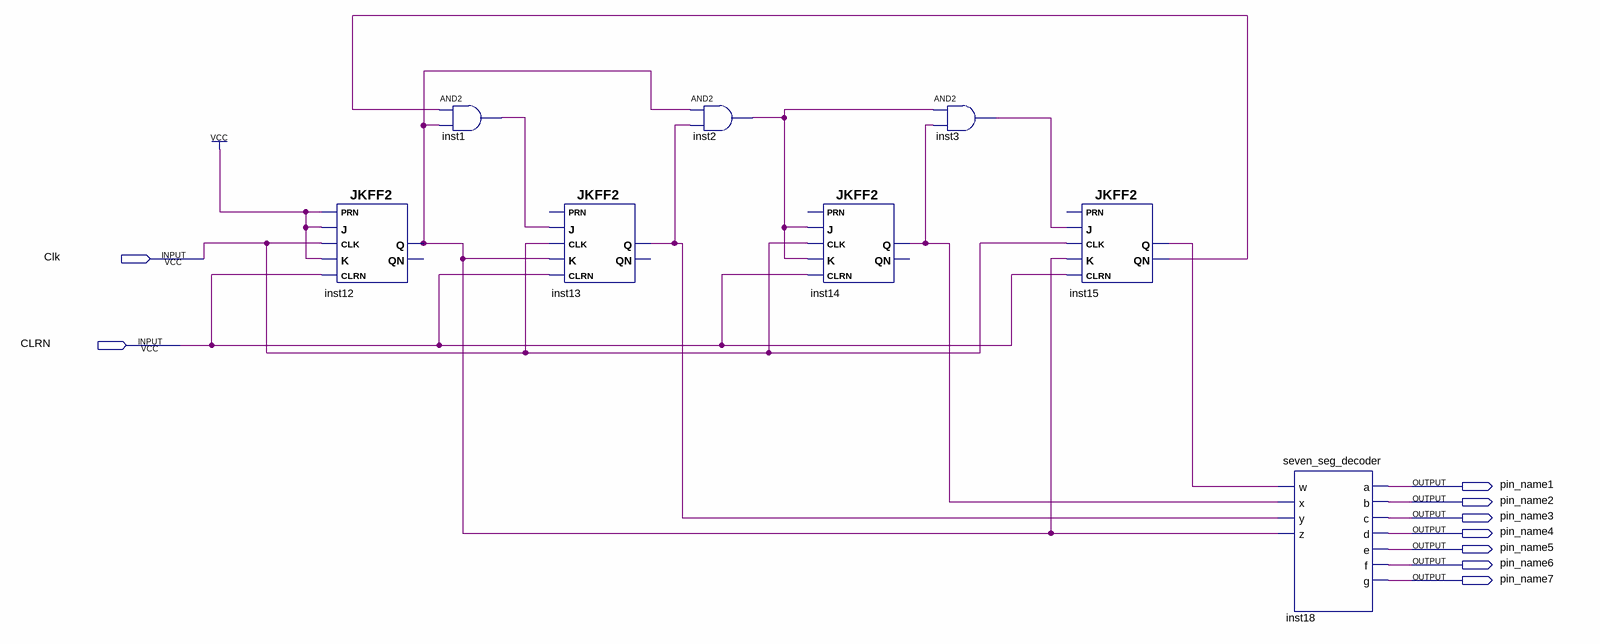
[diagram p0: schematic sheet]
// Quartus schematic scoreCounter.bdf as structural Verilog: 8 symbols, 9 pins
module scoreCounter (
  input  Clk,
  input  CLRN,
  output pin_name1,
  output pin_name2,
  output pin_name3,
  output pin_name4,
  output pin_name5,
  output pin_name6,
  output pin_name7
);

  wire inst1_out, inst2_out, inst3_out, inst12_q, inst13_q, inst14_q, inst15_q, inst15_qn;

  JKFF2 inst12 (.K(1'b1), .CLRN(CLRN), .CLK(Clk), .PRN(1'b1), .J(1'b1), .Q(inst12_q));  // open: QN
  and inst1 (inst1_out, inst15_qn, inst12_q);
  JKFF2 inst13 (.K(inst12_q), .CLRN(CLRN), .CLK(Clk), .J(inst1_out), .Q(inst13_q));  // open: PRN, QN
  and inst2 (inst2_out, inst12_q, inst13_q);
  JKFF2 inst14 (.K(inst2_out), .CLRN(CLRN), .CLK(Clk), .J(inst2_out), .Q(inst14_q));  // open: PRN, QN
  and inst3 (inst3_out, inst2_out, inst14_q);
  JKFF2 inst15 (.K(inst12_q), .CLRN(CLRN), .CLK(Clk), .J(inst3_out), .QN(inst15_qn), .Q(inst15_q));  // open: PRN
  seven_seg_decoder inst18 (
    .w(inst15_q), .x(inst14_q), .y(inst13_q), .z(inst12_q), .a(pin_name1), .b(pin_name2), .c(pin_name3),
    .d(pin_name4), .e(pin_name5), .f(pin_name6), .g(pin_name7));
endmodule
